# Altium schematic sheet SLT3-PAY-1Q2T_P4.SchDoc
size A4
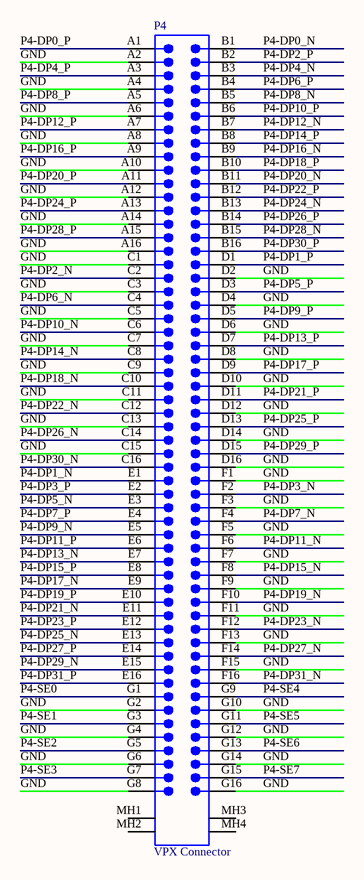
[diagram p0: SLT3-PAY-1Q2T_P4.SchDoc]

## Parts
P4  VPX Connector  [BTB1-8-4H112M]

## Nets
GND: P4.A2 P4.A4 P4.A6 P4.A8 P4.A10 P4.A12 P4.A14 P4.A16 P4.C1 P4.C3 P4.C5 P4.C7 P4.C9 P4.C11 P4.C13 P4.C15 P4.D2 P4.D4 P4.D6 P4.D8 P4.D10 P4.D12 P4.D14 P4.D16 P4.F1 P4.F3 P4.F5 P4.F7 P4.F9 P4.F11 P4.F13 P4.F15 P4.G2 P4.G4 P4.G6 P4.G8 P4.G10 P4.G12 P4.G14 P4.G16
P4-DP0_N: P4.B1
P4-DP0_P: P4.A1
P4-DP1_N: P4.E1
P4-DP1_P: P4.D1
P4-DP2_N: P4.C2
P4-DP2_P: P4.B2
P4-DP3_N: P4.F2
P4-DP3_P: P4.E2
P4-DP4_N: P4.B3
P4-DP4_P: P4.A3
P4-DP5_N: P4.E3
P4-DP5_P: P4.D3
P4-DP6_N: P4.C4
P4-DP6_P: P4.B4
P4-DP7_N: P4.F4
P4-DP7_P: P4.E4
P4-DP8_N: P4.B5
P4-DP8_P: P4.A5
P4-DP9_N: P4.E5
P4-DP9_P: P4.D5
P4-DP10_N: P4.C6
P4-DP10_P: P4.B6
P4-DP11_N: P4.F6
P4-DP11_P: P4.E6
P4-DP12_N: P4.B7
P4-DP12_P: P4.A7
P4-DP13_N: P4.E7
P4-DP13_P: P4.D7
P4-DP14_N: P4.C8
P4-DP14_P: P4.B8
P4-DP15_N: P4.F8
P4-DP15_P: P4.E8
P4-DP16_N: P4.B9
P4-DP16_P: P4.A9
P4-DP17_N: P4.E9
P4-DP17_P: P4.D9
P4-DP18_N: P4.C10
P4-DP18_P: P4.B10
P4-DP19_N: P4.F10
P4-DP19_P: P4.E10
P4-DP20_N: P4.B11
P4-DP20_P: P4.A11
P4-DP21_N: P4.E11
P4-DP21_P: P4.D11
P4-DP22_N: P4.C12
P4-DP22_P: P4.B12
P4-DP23_N: P4.F12
P4-DP23_P: P4.E12
P4-DP24_N: P4.B13
P4-DP24_P: P4.A13
P4-DP25_N: P4.E13
P4-DP25_P: P4.D13
P4-DP26_N: P4.C14
P4-DP26_P: P4.B14
P4-DP27_N: P4.F14
P4-DP27_P: P4.E14
P4-DP28_N: P4.B15
P4-DP28_P: P4.A15
P4-DP29_N: P4.E15
P4-DP29_P: P4.D15
P4-DP30_N: P4.C16
P4-DP30_P: P4.B16
P4-DP31_N: P4.F16
P4-DP31_P: P4.E16
P4-SE0: P4.G1
P4-SE1: P4.G3
P4-SE2: P4.G5
P4-SE3: P4.G7
P4-SE4: P4.G9
P4-SE5: P4.G11
P4-SE6: P4.G13
P4-SE7: P4.G15

Not connected (* = marked no-connect by the designer): P4 MH1 MH2 MH3 MH4

## Library data of the parts
P4 = 2102771-1: Ruggedized Board-to-Board Connector, Right Angle, 7-Row, Pitch 1.8mm, 112-Position; Manufacturer: TE; Bonding: No; ComponentHeigth: 14.7mm; PressFit: No; Case: *; Component Kind: Standard; Component Type: Standard; CreateDate: 2018-01-01; Device: *; Footprint: *; HelpURL: *; LatestRevisionDate: 2018-01-01; Manufacturer Part Number: 2102771-1; Mounted: Yes; PackageDescription: 2102771-1; Part Description: Ruggedized Board-to-Board Connector, Right Angle, 7-Row, Pitch 1.8mm, 112-Position; Part Number: 2102771-1; Pin Count: *; Sense: No; SMD: Yes; Socket: No; Family: VPX Connector